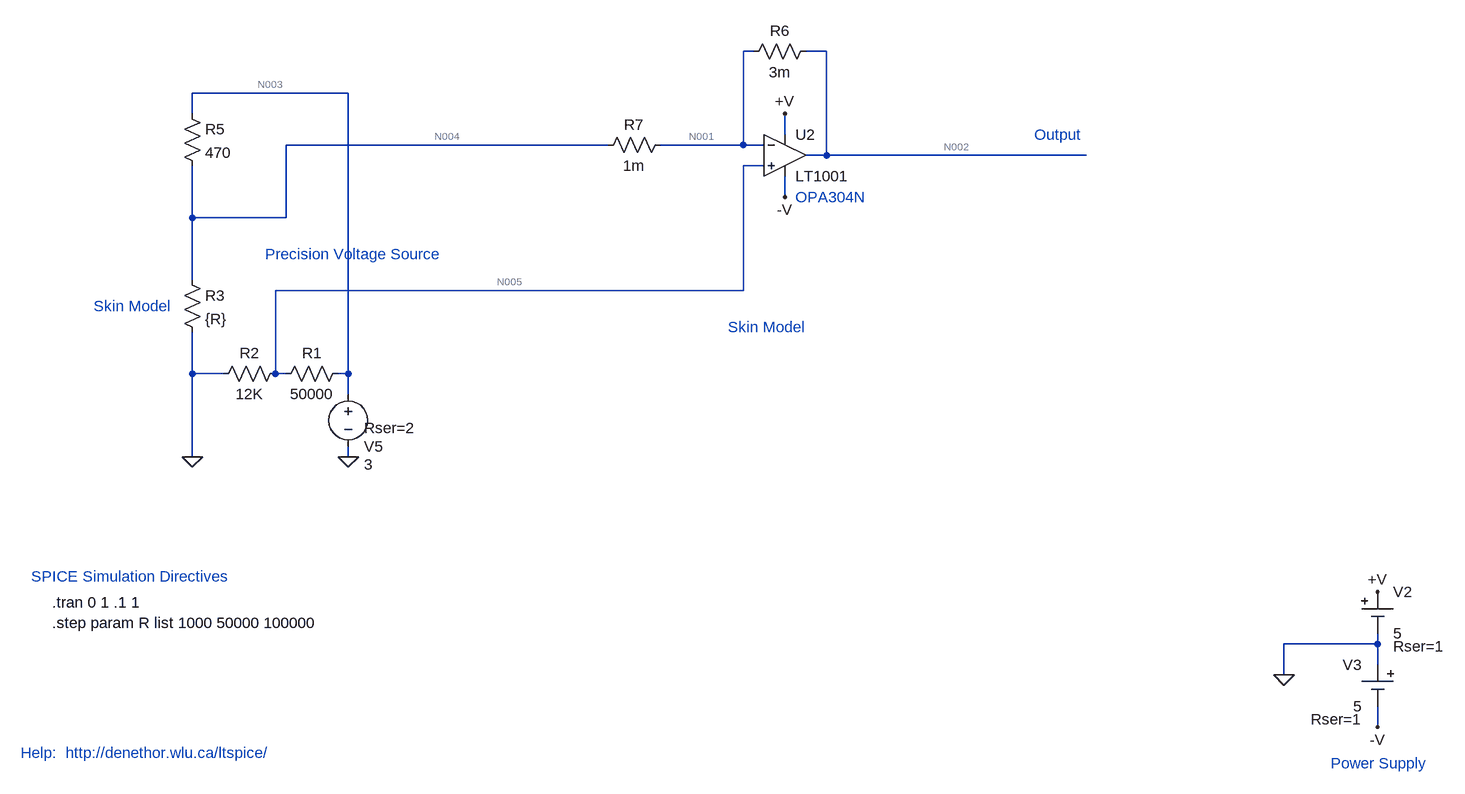
[diagram p0: schematic GSR1.asc]
GSR1.asc, the LTspice schematic file:
Version 4
SHEET 1 1356 1016
WIRE -224 -224 -240 -224
WIRE -112 -224 -144 -224
WIRE -848 -160 -1088 -160
WIRE -1088 -128 -1088 -160
WIRE -176 -96 -176 -128
WIRE -448 -80 -944 -80
WIRE -240 -80 -240 -224
WIRE -240 -80 -368 -80
WIRE -208 -80 -240 -80
WIRE -112 -64 -112 -224
WIRE -112 -64 -144 -64
WIRE 288 -64 -112 -64
WIRE -208 -48 -240 -48
WIRE -176 0 -176 -32
WIRE -1088 32 -1088 -48
WIRE -944 32 -944 -80
WIRE -944 32 -1088 32
WIRE -1088 128 -1088 32
WIRE -240 144 -240 -48
WIRE -240 144 -960 144
WIRE -1088 272 -1088 208
WIRE -1040 272 -1088 272
WIRE -960 272 -960 144
WIRE -944 272 -960 272
WIRE -848 272 -848 -160
WIRE -848 272 -864 272
WIRE -848 304 -848 272
WIRE -1088 400 -1088 272
WIRE -848 400 -848 384
WIRE 736 688 736 672
WIRE 736 688 592 688
WIRE 736 720 736 688
WIRE 592 736 592 688
WIRE 736 816 736 784
FLAG 736 608 +V
FLAG 736 816 -V
FLAG 592 736 0
FLAG -176 0 -V
FLAG -176 -128 +V
FLAG -848 400 0
FLAG -1088 400 0
SYMBOL Opamps\\LT1001 -176 -128 R0
SYMATTR InstName U2
SYMBOL Misc\\cell 736 608 R0
WINDOW 123 0 0 Left 2
WINDOW 39 24 84 Left 2
SYMATTR SpiceLine Rser=1
SYMATTR InstName V2
SYMATTR Value 5
SYMBOL Misc\\cell 736 720 M0
WINDOW 123 0 0 Left 2
WINDOW 39 24 84 Left 2
SYMATTR SpiceLine Rser=1
SYMATTR InstName V3
SYMATTR Value 5
SYMBOL voltage -848 288 R0
WINDOW 0 24 96 Left 2
WINDOW 3 24 124 Left 2
WINDOW 39 24 68 Left 2
WINDOW 123 0 0 Left 2
SYMATTR InstName V5
SYMATTR Value 3
SYMATTR SpiceLine Rser=2
SYMBOL res -1104 112 R0
SYMATTR InstName R3
SYMATTR Value {R}
SYMBOL res -1104 -144 R0
SYMATTR InstName R5
SYMATTR Value 470
SYMBOL res -128 -240 R90
WINDOW 0 0 56 VBottom 2
WINDOW 3 32 56 VTop 2
SYMATTR InstName R6
SYMATTR Value 3m
SYMBOL res -352 -96 R90
WINDOW 0 0 56 VBottom 2
WINDOW 3 32 56 VTop 2
SYMATTR InstName R7
SYMATTR Value 1m
SYMBOL res -944 256 R90
WINDOW 0 0 56 VBottom 2
WINDOW 3 32 56 VTop 2
SYMATTR InstName R2
SYMATTR Value 12K
SYMBOL res -848 256 R90
WINDOW 0 0 56 VBottom 2
WINDOW 3 32 56 VTop 2
SYMATTR InstName R1
SYMATTR Value 50000
TEXT -1352 856 Left 2 ;Help:  http://denethor.wlu.ca/ltspice/
TEXT -1336 584 Left 2 ;SPICE Simulation Directives
TEXT -1304 624 Left 2 !.tran 0 1 .1 1
TEXT -264 200 Left 2 ;Skin Model
TEXT -976 88 Left 2 ;Precision Voltage Source
TEXT -1304 656 Left 2 !.step param R list 1000 50000 100000
TEXT -160 0 Left 2 ;OPA304N
TEXT 208 -96 Left 2 ;Output
TEXT 664 872 Left 2 ;Power Supply
TEXT -1240 168 Left 2 ;Skin Model

The netlist it stands for:
* GSR1.asc
XU2 N005 N001 +V -V N002 LT1001  ; pins In+ In- V+ V- OUT
V2 +V 0 5 Rser=1
V3 0 -V 5 Rser=1
V5 N003 0 3 Rser=2
R3 N004 0 {R}
R5 N003 N004 470
R6 N002 N001 3m
R7 N001 N004 1m
R2 N005 0 12K
R1 N003 N005 50000
* Help:  http://denethor.wlu.ca/ltspice/
* SPICE Simulation Directives
.tran 0 1 .1 1
* Skin Model
* Precision Voltage Source
.step param R list 1000 50000 100000
* OPA304N
* Output
* Power Supply
* Skin Model
.lib LTC.lib
.backanno
.end

* Results of the author's LTspice run, read from the files saved beside the schematic
* Operating Point (first step), zero values left out:
*   r = 1 k
*   V(n001) = 578.6 mV
*   V(n005) = 578.6 mV
*   V(+v) = 4.999 V
*   V(-v) = -4.995 V
*   V(n002) = 578.6 mV
*   V(n003) = 2.99 V
*   V(n004) = 578.6 mV
*   I(R1) = 48.22 µA
*   I(R2) = 48.22 µA
*   I(R7) = -4.551 mA
*   I(R6) = -4.551 mA
*   I(R5) = 5.13 mA
*   I(R3) = 578.6 µA
*   I(V5) = -5.178 mA
*   I(V3) = -5.101 mA
*   I(V2) = -549.8 µA
*   Ix(u2:1) = 1.037 pA
*   Ix(u2:2) = 1.022 pA
*   Ix(u2:3) = 549.8 µA
*   Ix(u2:4) = -5.101 mA
*   Ix(u2:5) = 4.551 mA